# EAGLE schematic layout-tutorial (EAGLE 9.6.2)
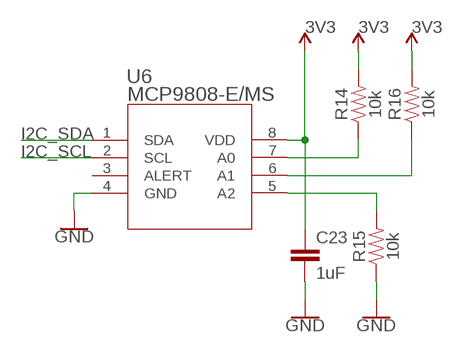
[diagram p0: schematic, sheet 1]

## Parts
C23  1uF  0.1UF-0603-100V-10%  [0603@1]
R14  10k  10KOHM-0603-1/10W-1%  [0603]
R15  10k  10KOHM-0603-1/10W-1%  [0603]
R16  10k  10KOHM-0603-1/10W-1%  [0603]
U6  MCP9808-E/MS  [MSOP8_MC]

## Nets
3V3: C23.1 R14.2 R16.2 U6.8(VDD) ; supply symbol labelled 3.3V
GND: C23.2 R15.1 U6.4(GND)
I2C_SCL: U6.2(SCL)
I2C_SDA: U6.1(SDA)
N$21: R15.2 U6.5(A2)
N$26: R16.1 U6.6(A1)
N$27: R14.1 U6.7(A0)
Unconnected: U6.3(ALERT)

## Library data of the parts
C23 = SparkFun-Capacitors:0.1UF: 0.1µF ceramic capacitors A capacitor is a passive two-terminal electrical component used to store electrical energy temporarily in an electric field.; PROD_ID: CAP-08390; VALUE: 0.1uF
R14-R16 = SparkFun-Resistors:10KOHM: 10kΩ resistor A resistor is a passive two-terminal electrical component that implements electrical resistance as a circuit element. Resistors act to reduce current flow, and, at the same time, act to lower voltage levels within circuits. - Wikipedia; PROD_ID: RES-00824
U6 = MCP9808-E:MS:MCP9808-E/MS